# EAGLE design Slider01 (EAGLE 6.5.0)
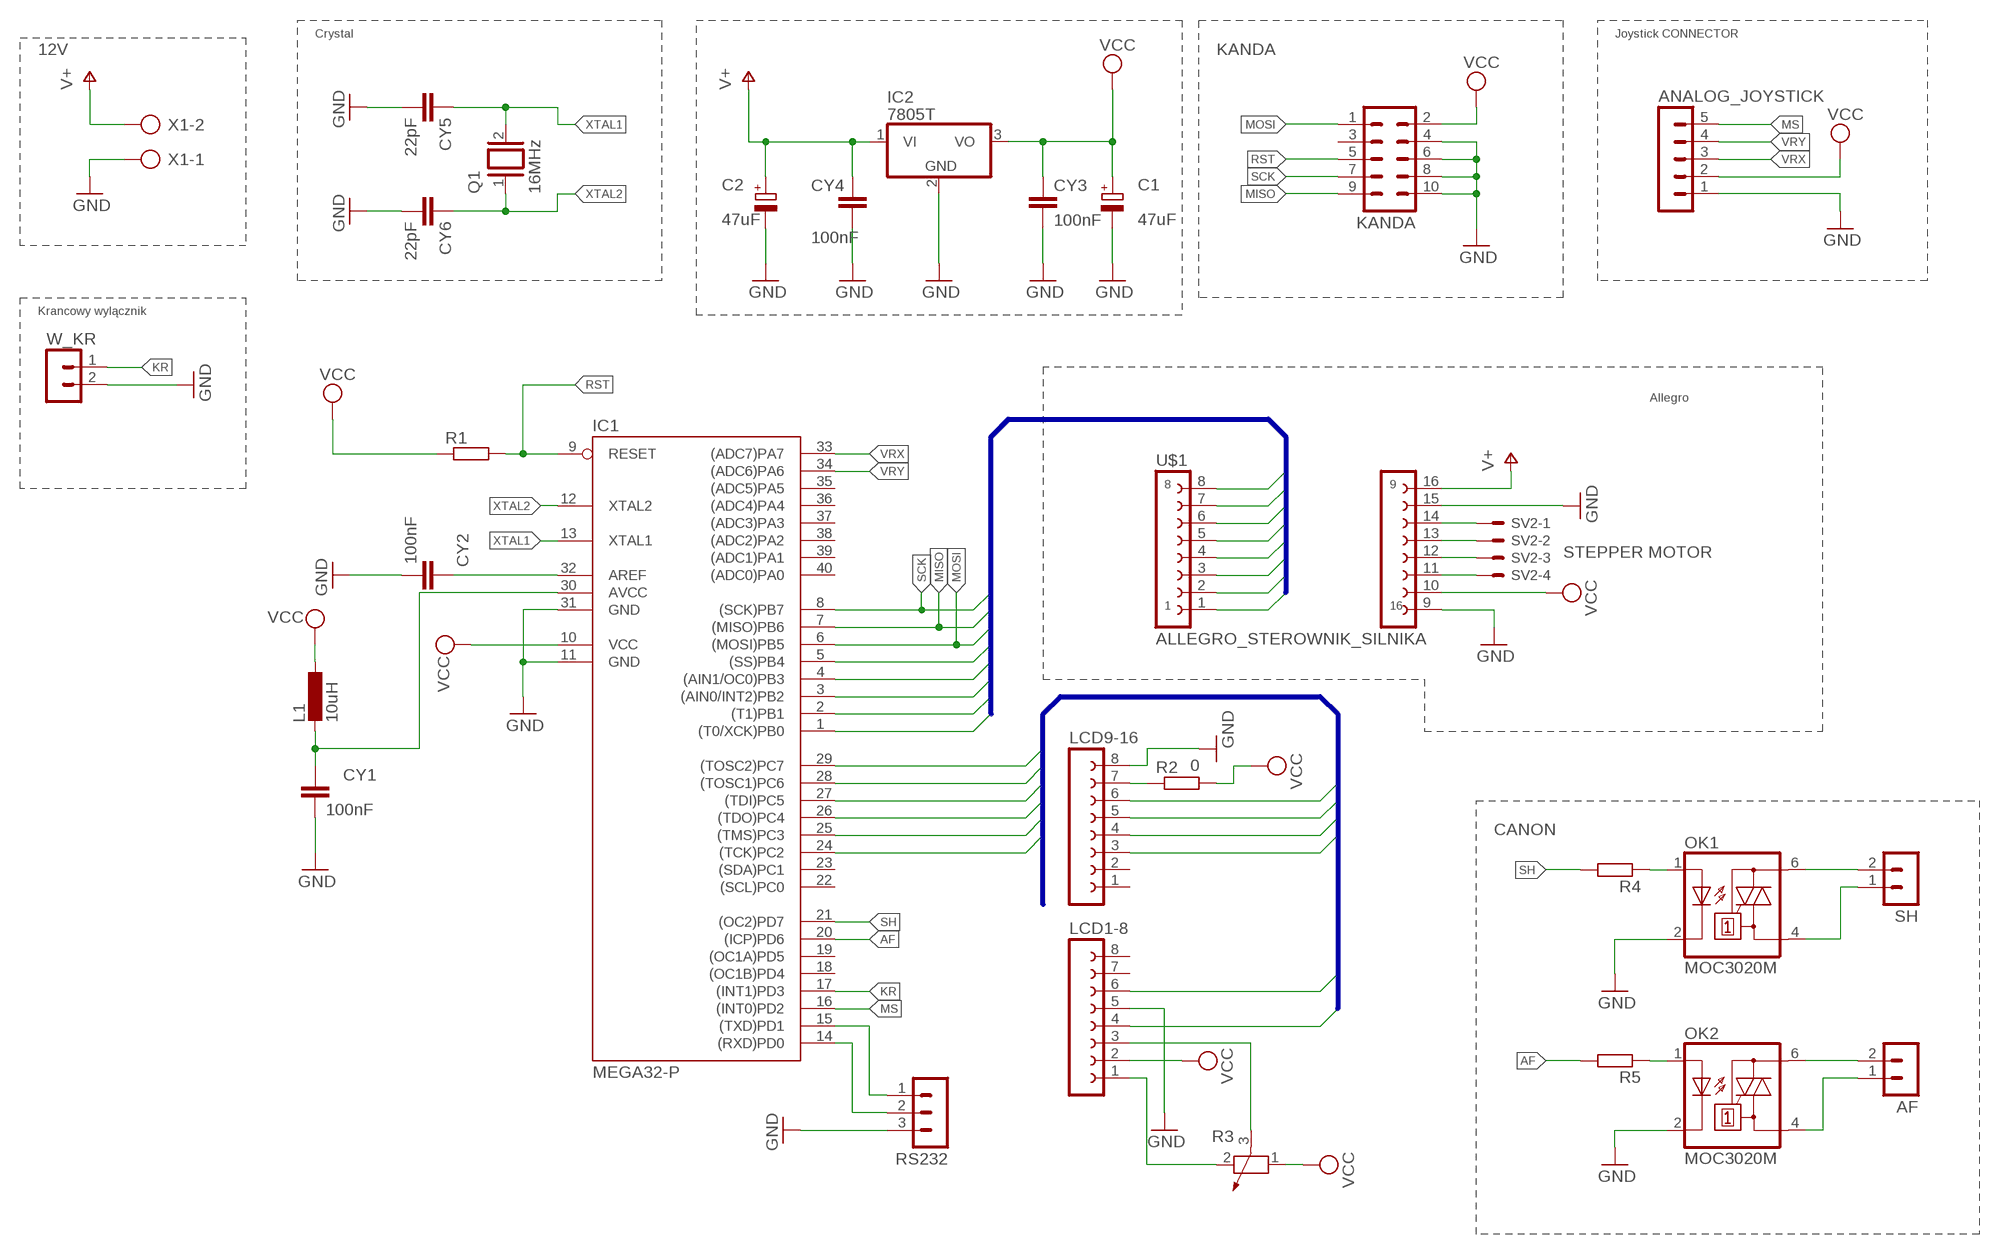
[diagram p0: schematic, sheet 1]

## Parts
AF  LSTB2  [LSTB2]
ANALOG_JOYSTICK  MA05-1  [MA05-1]
C1  47uF  CPOL-EUE5-6  [E5-6]
C2  47uF  CPOL-EUE5-6  [E5-6]
CY1  100nF  C-EU050-024X044  [C050-024X044]
CY2  100nF  C-EU050-024X044  [C050-024X044]
CY3  100nF  C-EU050-024X044  [C050-024X044]
CY4  100nF  C-EU050-024X044  [C050-024X044]
CY5  22pF  C-EUC1206  [C1206]
CY6  22pF  C-EUC1206  [C1206]
IC1  MEGA32-P  [DIL40]
IC2  7805T  [TO220H]
KANDA  MA05-2  [MA05-2]
L1  10uH  L-EU0207/10  [0207/10]
LCD1-8  FE08-1  [FE08]
LCD9-16  FE08-1  [FE08]
OK1  MOC3020M  [DIL06]
OK2  MOC3020M  [DIL06]
Q1  16MHz  XTAL/S  [QS]
R1  R-EU_0207/7  [0207/7]
R2  0  R-EU_0207/12  [0207/12]
R3  POTENTIOMETER_PT-10  [PT-10]
R4  R-EU_0207/7  [0207/7]
R5  R-EU_0207/7  [0207/7]
RS232  MA03-1  [MA03-1]
SH  LSTB2  [LSTB2]
SV2  KK-156-4  [KK-156-4]
U$1  ALLEGRO_STEROWNIK_SILNIKA  [ALLEGRO_STEROWNIK]
W_KR  LSTB2  [LSTB2]
X1  AK500/2  [AK500/2]

## Nets
#E: IC1.25((TMS)PC3) LCD1-8.6
AF: IC1.20((ICP)PD6) R5.2
D4: IC1.26((TDO)PC4) LCD9-16.3
D5: IC1.27((TDI)PC5) LCD9-16.4
D6: IC1.28((TOSC1)PC6) LCD9-16.5
D7: IC1.29((TOSC2)PC7) LCD9-16.6
GND: ANALOG_JOYSTICK.1 C1.- C2.- CY1.2 CY2.2 CY3.2 CY4.2 CY5.2 CY6.2 IC1.11(GND) IC1.31(GND) IC2.2(GND) KANDA.4 KANDA.6 KANDA.8 KANDA.10 LCD1-8.5 LCD9-16.8 OK1.2(C) OK2.2(C) RS232.3 U$1.9(A16) U$1.15(A10) W_KR.2 X1.1
KR: IC1.17((INT1)PD3) W_KR.1
MISO: IC1.7((MISO)PB6) KANDA.9 U$1.7
MOSI: IC1.6((MOSI)PB5) KANDA.1 U$1.6
MS: ANALOG_JOYSTICK.5 IC1.16((INT0)PD2)
N$1: SV2.1 U$1.14(A11)
N$2: SV2.2 U$1.13(A12)
N$3: SV2.3 U$1.12(A13)
N$4: SV2.4 U$1.11(A14)
N$5: LCD9-16.7 R2.1
N$6: CY2.1 IC1.32(AREF)
N$7: CY1.1 IC1.30(AVCC) L1.2
N$8: LCD1-8.1 R3.2
N$9: LCD1-8.3 R3.3
N$10: OK1.1(A) R4.1
N$11: OK2.1(A) R5.1
N$12: OK1.6(A2) SH.2
N$13: OK1.4(A1) SH.1
N$14: AF.2 OK2.6(A2)
N$15: AF.1 OK2.4(A1)
N$16: IC1.15((TXD)PD1) RS232.1
N$17: IC1.14((RXD)PD0) RS232.2
PB0: IC1.1((T0/XCK)PB0) U$1.1
PB1: IC1.2((T1)PB1) U$1.2
PB2: IC1.3((AIN0/INT2)PB2) U$1.3
PB3: IC1.4((AIN1/OC0)PB3) U$1.4
PB4: IC1.5((SS)PB4) U$1.5
RS: IC1.24((TCK)PC2) LCD1-8.4
RST: IC1.9(RESET) KANDA.5 R1.2
SCK: IC1.8((SCK)PB7) KANDA.7 U$1.8
SH: IC1.21((OC2)PD7) R4.2
V+: C2.+ CY4.1 IC2.1(VI) U$1.16(A9) X1.2
VCC: ANALOG_JOYSTICK.2 C1.+ CY3.1 IC1.10(VCC) IC2.3(VO) KANDA.2 L1.1 LCD1-8.2 R1.1 R2.2 R3.1 U$1.10(A15)
VRX: ANALOG_JOYSTICK.3 IC1.33((ADC7)PA7)
VRY: ANALOG_JOYSTICK.4 IC1.34((ADC6)PA6)
XTAL1: CY5.1 IC1.13(XTAL1) Q1.2
XTAL2: CY6.1 IC1.12(XTAL2) Q1.1
Unconnected: IC1.18((OC1B)PD4) IC1.19((OC1A)PD5) IC1.22((SCL)PC0) IC1.23((SDA)PC1) IC1.35((ADC5)PA5) IC1.36((ADC4)PA4) IC1.37((ADC3)PA3) IC1.38((ADC2)PA2) IC1.39((ADC1)PA1) IC1.40((ADC0)PA0) KANDA.3 LCD1-8.7 LCD1-8.8 LCD9-16.1 LCD9-16.2

## Buses
PB[0..4],MISO,MOSI,SCK,SS
D[4..7],RS,#E

## Notes on the sheet
- Crystal | Joystick CONNECTOR
- 12V | KANDA
- Krancowy wylącznik
- Allegro
- STEPPER MOTOR
- CANON

## Library data of the parts
AF SH W_KR = _My_Zlacza_nietypowe:LSTB2
ANALOG_JOYSTICK = con-lstb:MA05-1: PIN HEADER; OC_FARNELL: unknown; OC_NEWARK: unknown
C1 C2 = rcl:CPOL-EU: POLARIZED CAPACITOR, European symbol
CY1-CY6 = rcl:C-EU: CAPACITOR, European symbol
IC1 = atmel:MEGA32-P: MICROCONTROLLER 32 Kbytes FLASH 2 Kbytes SRAM 1 Kbytes EEPROM USART 8-channel 10 bit ADC Source: www.atmel.com .. doc2503.pdf; MPN: ATMEGA32-16PU; OC_FARNELL: 1661729; OC_NEWARK: 51P1794
IC2 = linear:78*: Positive VOLTAGE REGULATOR Source: http://cache.national.com/ds/LM/LM78L05.pdf http://www.fairchildsemi.com/ds/LM/LM7805.pdf
KANDA = con-lstb:MA05-2: PIN HEADER; OC_FARNELL: unknown; OC_NEWARK: unknown
L1 = rcl:L-EU: INDUCTOR, European symbol
LCD1-8 LCD9-16 = con-lsta:FE08-1: FEMALE HEADER; OC_FARNELL: unknown; OC_NEWARK: unknown
OK1 OK2 = optocoupler:MOC30*M: RANDOM-PHASE OPTOISOLATORS TRIAC DRIVER OUTPUT Source: http://www.fairchildsemi.com MOC3020-M.pdf; MF: FAIRCHILD SEMICONDUCTOR; MPN: MOC3020-M; OC_FARNELL: 1505425; OC_NEWARK: 72K8895
Q1 = special:XTAL/S: CRYSTAL
R1 R2 R4 R5 = rcl:R-EU_: RESISTOR, European symbol
R3 = rcl:POTENTIOMETER_: Potentiometer
RS232 = con-lstb:MA03-1: PIN HEADER; OC_FARNELL: unknown; OC_NEWARK: unknown
SV2 = con-molex:KK-156-4: KK 156 HEADER Source: http://www.molex.com/pdm_docs/sd/026604100_sd.pdf; OC_FARNELL: unknown; OC_NEWARK: unknown
U$1 = _My_trafko:ALLEGRO_STEROWNIK_SILNIKA
X1 = con-ptr500:AK500/2: CONNECTOR; OC_FARNELL: unknown; OC_NEWARK: unknown

## Board
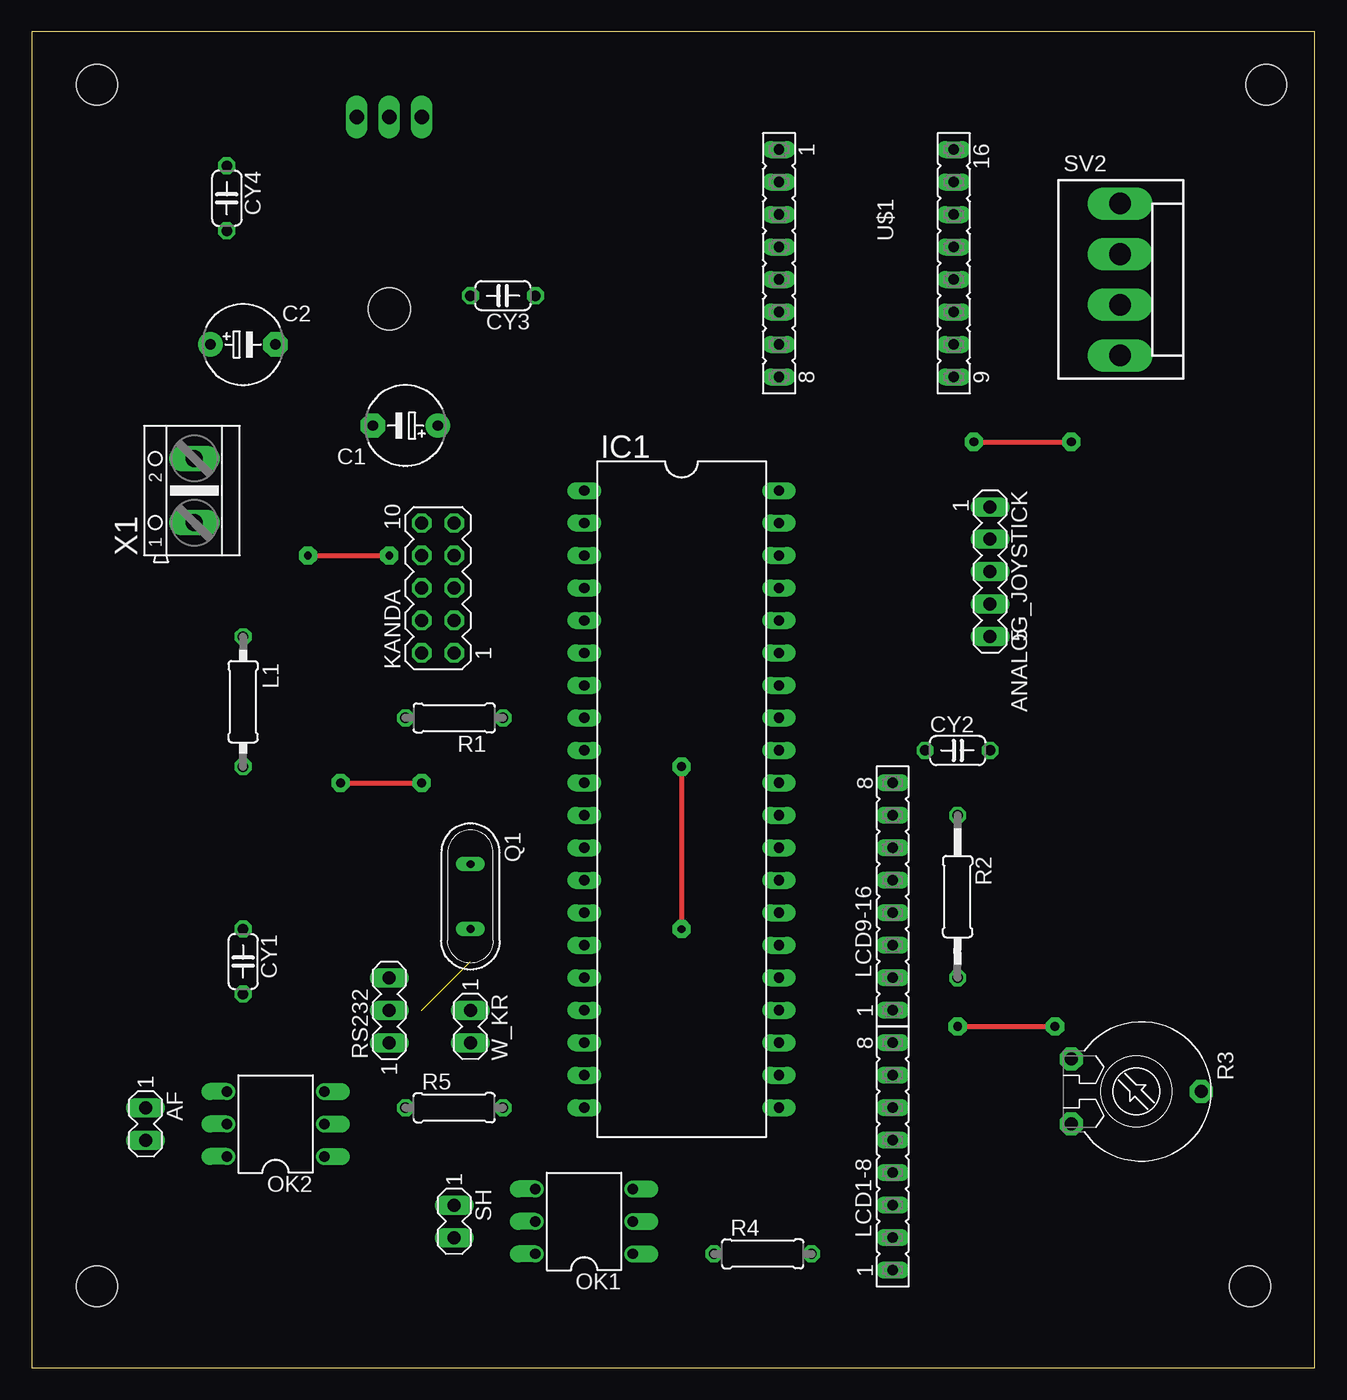
[diagram p1: board, top side]
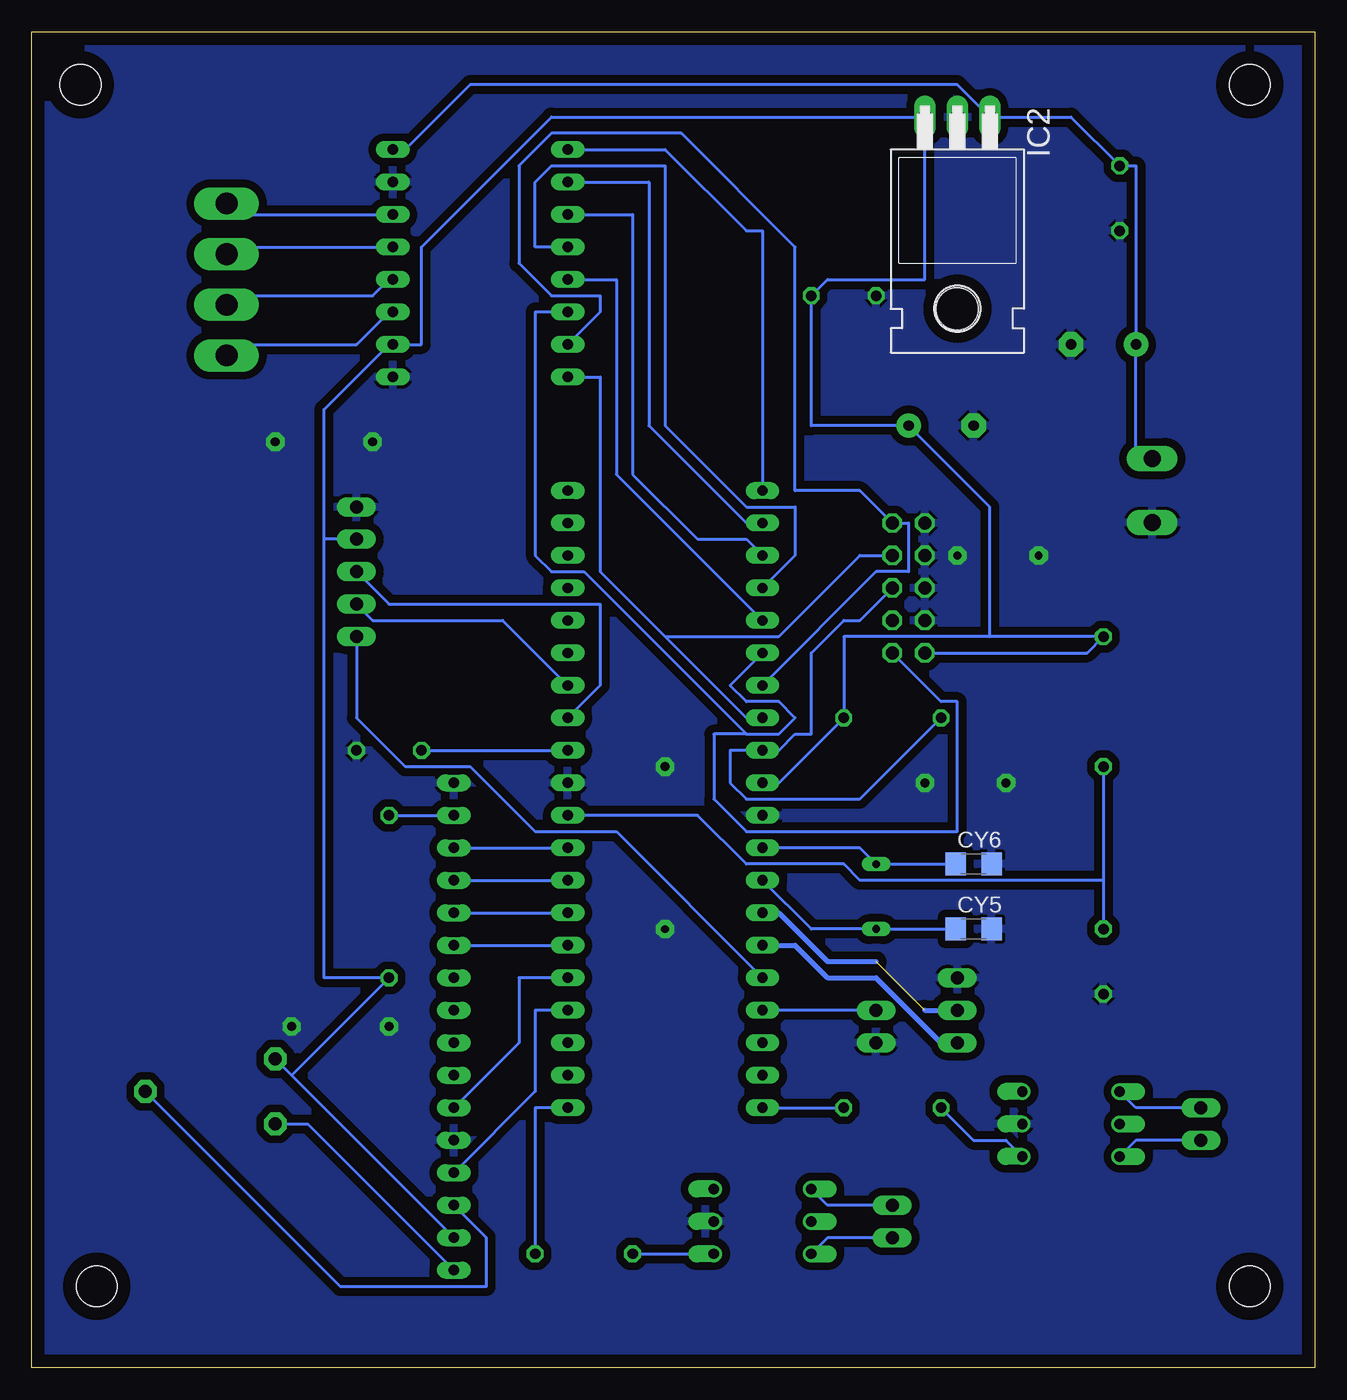
[diagram p2: board, bottom side, seen from below]

Size 100.31 x 104.44 mm. Coordinates in mm from the lower left corner, seen from the top.
Outline: 0,0 100.31,0 100.31,104.44 0,104.44 0,0
Copper layers (1*16): Top 0.035mm / dielectric 1.5mm / Bottom 0.035mm
Design rules "default *": minimum track width 10mil, minimum drill 24mil, track to track 8mil, track to pad 8mil, pad to pad 8mil, via to via 8mil, smd to smd 8mil, copper to edge 40mil, drill to drill 8mil, minimum pad ring 10mil, minimum via ring 8mil, stop-mask expansion 4mil, vias tented up to drill 0mil, thermal gap 10mil
Holes 3.2 mm at 5.08,100.33 96.52,100.33 95.25,6.35 5.08,6.35

### Footprints (pad centres in the part's own frame; a part is rotated, then mirrored left to right if it is on the bottom)
LSTB2 = drill 1.016 long: 1 -1.27,0; 2 1.27,0
MA05-1 = drill 1.016 long: 1 -5.08,0; 2 -2.54,0; 3 0,0; 4 2.54,0; 5 5.08,0
E5-6 = drill 0.813 pad 1.905: + -2.54,0 | drill 0.813 pad 1.905 octagon: - 2.54,0
C050-024X044 = drill 0.813 octagon: 1 -2.54,0; 2 2.54,0
C1206 = smd 1.6 x 1.8: 1 -1.4,0; 2 1.4,0
DIL40 = drill 0.813 long: 1 -24.13,-7.62; 2 -21.59,-7.62; 3 -19.05,-7.62; 4 -16.51,-7.62; 5 -13.97,-7.62; 6 -11.43,-7.62; 7 -8.89,-7.62; 8 -6.35,-7.62; 9 -3.81,-7.62; 10 -1.27,-7.62; 11 1.27,-7.62; 12 3.81,-7.62; 13 6.35,-7.62; 14 8.89,-7.62; 15 11.43,-7.62; 16 13.97,-7.62; 17 16.51,-7.62; 18 19.05,-7.62; 19 21.59,-7.62; 20 24.13,-7.62; 21 24.13,7.62; 22 21.59,7.62; 23 19.05,7.62; 24 16.51,7.62; 25 13.97,7.62; 26 11.43,7.62; 27 8.89,7.62; 28 6.35,7.62; 29 3.81,7.62; 30 1.27,7.62; 31 -1.27,7.62; 32 -3.81,7.62; 33 -6.35,7.62; 34 -8.89,7.62; 35 -11.43,7.62; 36 -13.97,7.62; 37 -16.51,7.62; 38 -19.05,7.62; 39 -21.59,7.62; 40 -24.13,7.62
TO220H = drill 1.118 long: 1 -2.54,-10.16; 2 0,-10.16; 3 2.54,-10.16 | hole 3.302: 0,4.826
MA05-2 = drill 1.016 octagon: 1 -5.08,-1.27; 2 -5.08,1.27; 3 -2.54,-1.27; 4 -2.54,1.27; 5 0,-1.27; 6 0,1.27; 7 2.54,-1.27; 8 2.54,1.27; 9 5.08,-1.27; 10 5.08,1.27
0207/10 = drill 0.813 octagon: 1 -5.08,0; 2 5.08,0
FE08 = drill 0.813 long: 1 -8.89,0; 2 -6.35,0; 3 -3.81,0; 4 -1.27,0; 5 1.27,0; 6 3.81,0; 7 6.35,0; 8 8.89,0
DIL06 = drill 0.813 offset: 1 -2.54,-3.81; 2 0,-3.81; 3 2.54,-3.81; 4 2.54,3.81; 5 0,3.81; 6 -2.54,3.81
QS = drill 0.61 long: 1 -2.54,0; 2 2.54,0
0207/7 = drill 0.813 octagon: 1 -3.81,0; 2 3.81,0
0207/12 = drill 0.813 octagon: 1 -6.35,0; 2 6.35,0
PT-10 = drill 1.016 pad 1.778 octagon: 1 -2.54,-5.08; 2 2.54,-5.08; 3 0,5.08
MA03-1 = drill 1.016 long: 1 -2.54,0; 2 0,0; 3 2.54,0
KK-156-4 = drill 1.7 pad 2.184 long: 1 -5.94,0; 2 -1.98,0; 3 1.98,0; 4 5.94,0
ALLEGRO_STEROWNIK = drill 0.813 long: 1 0,0; 2 2.54,0; 3 5.08,0; 4 7.62,0; 5 10.16,0; 6 12.7,0; 7 15.24,0; 8 17.78,0; 9 17.78,13.665; 10 15.24,13.665; 11 12.7,13.665; 12 10.16,13.665; 13 7.62,13.665; 14 5.08,13.665; 15 2.54,13.665; 16 0,13.665
AK500/2 = drill 1.321 long: 1 -2.515,0; 2 2.515,0

### Placement (x,y rotation side)
AF  8.89,19.05 270 top
ANALOG_JOYSTICK  74.93,62.23 270 top
C1  29.21,73.66 180 top
C2  16.51,80.01 0 top
CY1  16.51,31.75 270 top
CY2  72.39,48.26 0 top
CY3  36.83,83.82 180 top
CY4  15.24,91.44 270 top
CY5  26.67,34.29 0 bottom
CY6  26.67,39.37 0 bottom
IC1  50.8,44.45 270 top
IC2  27.94,87.63 180 bottom
KANDA  31.75,60.96 90 top
L1  16.51,52.07 270 top
LCD1-8  67.31,16.51 90 top
LCD9-16  67.31,36.83 90 top
OK1  43.18,11.43 90 top
OK2  19.05,19.05 90 top
Q1  34.29,36.83 270 top
R1  33.02,50.8 180 top
R2  72.39,36.83 270 top
R3  86.36,21.59 270 top
R4  57.15,8.89 0 top
R5  33.02,20.32 0 top
RS232  27.94,27.94 90 top
SH  33.02,11.43 270 top
SV2  85.09,85.09 270 top
U$1  58.42,95.25 270 top
W_KR  34.29,26.67 270 top
X1  12.7,68.58 90 top

### Tracks (layer width: path | path; a pad name or v marks a point on that pad's centre or on a via)
#E
  Bottom 0.254: LCD1-8.6 62.23,25.4 62.23,30.48 IC1.25
AF
  Bottom 0.254: IC1.20 R5.2
D4
  Bottom 0.254: LCD9-16.3 IC1.26
D5
  Bottom 0.254: LCD9-16.4 IC1.27
D6
  Bottom 0.254: LCD9-16.5 IC1.28
D7
  Bottom 0.254: LCD9-16.6 IC1.29
GND  (via drill 0.6 pad 1.42, 0.7 pad 1.42)
  Top 0.406: v50.8,46.99 v50.8,34.29 | v24.13,45.72 v30.48,45.72 | v21.59,63.5 v27.94,63.5 | v72.39,26.67 v80.01,26.67 | v73.66,72.39 v81.28,72.39
  pour Bottom (isolate 0.61): -8.89,142.24 133.35,142.24 133.35,-6.35 -8.89,-6.35
KR
  Bottom 0.254: W_KR.1 IC1.17
MISO
  Bottom 0.254: IC1.7 34.29,62.23 31.75,62.23 31.75,66.04 KANDA.9 35.56,68.58 40.64,68.58 40.64,87.63 49.53,96.52 59.69,96.52 62.23,93.98 62.23,86.36 59.69,83.82 55.88,83.82 55.88,82.55 U$1.7
MOSI
  Bottom 0.254: IC1.6 45.72,53.34 44.45,52.07 41.91,52.07 40.64,50.8 41.91,49.53 44.45,49.53 | 44.45,49.53 57.15,62.23 59.69,62.23 60.96,63.5 60.96,82.55 U$1.6 | KANDA.1 29.21,52.07 27.94,52.07 27.94,41.91 44.45,41.91 46.99,44.45 46.99,49.53 44.45,49.53
MS
  Bottom 0.254: IC1.16 54.61,41.91 60.96,41.91 66.04,46.99 71.12,46.99 74.93,50.8 ANALOG_JOYSTICK.5
N$1
  Bottom 0.254: U$1.14 85.09,90.17 SV2.1
N$2
  Bottom 0.254: U$1.13 85.09,87.63 SV2.2
N$3
  Bottom 0.254: U$1.12 72.39,85.09 73.66,83.82 85.09,83.82 SV2.3
N$4
  Bottom 0.254: U$1.11 72.39,82.55 74.93,80.01 85.09,80.01 SV2.4
N$5
  Bottom 0.254: R2.1 LCD9-16.7
N$6
  Bottom 0.254: CY2.1 IC1.32
N$7
  Bottom 0.254: L1.2 16.51,38.1 | 16.51,38.1 CY1.1 | IC1.30 48.26,43.18 44.45,39.37 36.83,39.37 35.56,38.1 16.51,38.1
N$8
  Bottom 0.254: LCD1-8.1 78.74,19.05 R3.2
N$9
  Bottom 0.254: LCD1-8.3 64.77,10.16 64.77,6.35 76.2,6.35 R3.3
N$10
  Bottom 0.254: R4.1 OK1.1
N$11
  Bottom 0.254: OK2.1 24.13,17.78 26.67,17.78 R5.1
N$12
  Bottom 0.254: OK1.6 38.1,10.16 SH.2
N$13
  Bottom 0.254: OK1.4 38.1,12.7 SH.1
N$14
  Bottom 0.254: OK2.6 13.97,17.78 AF.2
N$15
  Bottom 0.254: OK2.4 13.97,20.32 AF.1
N$16
  Bottom 0.406: IC1.15 40.64,33.02 38.1,30.48 34.29,30.48 29.21,25.4 RS232.1
N$17  (1 unrouted)
  Bottom 0.406: IC1.14 41.91,35.56 38.1,31.75 34.29,31.75 | 30.48,27.94 RS232.2
PB0
  Bottom 0.254: IC1.1 43.18,88.9 44.45,88.9 50.8,95.25 U$1.1
PB1
  Bottom 0.254: IC1.2 44.45,66.04 52.07,73.66 52.07,92.71 U$1.2
PB2
  Bottom 0.254: IC1.3 44.45,64.77 48.26,64.77 53.34,69.85 53.34,90.17 U$1.3
PB3
  Bottom 0.254: IC1.4 40.64,63.5 40.64,67.31 44.45,67.31 50.8,73.66 50.8,93.98 59.69,93.98 60.96,92.71 60.96,87.63 U$1.4
PB4
  Bottom 0.254: IC1.5 54.61,69.85 54.61,85.09 U$1.5
RS
  Bottom 0.254: LCD1-8.4 60.96,21.59 60.96,27.94 IC1.24
RST
  Bottom 0.254: R1.2 35.56,44.45 44.45,44.45 45.72,45.72 45.72,48.26 IC1.9 41.91,48.26 40.64,49.53 39.37,49.53 39.37,55.88 36.83,58.42 35.56,58.42 KANDA.5
SCK
  Bottom 0.254: IC1.8 44.45,50.8 50.8,57.15 | 50.8,57.15 55.88,62.23 55.88,77.47 U$1.8 | KANDA.7 35.56,63.5 41.91,57.15 50.8,57.15
SH
  Bottom 0.254: R4.2 60.96,20.32 IC1.21
V+
  Bottom 0.254: X1.2 12.7,71.12 13.97,71.12 C2.+ 13.97,93.98 CY4.1 19.05,97.79 IC2.1 27.94,100.33 66.04,100.33 71.12,95.25 U$1.16
VCC
  Bottom 0.254: IC1.10 41.91,45.72 R1.1 36.83,57.15 25.4,57.15 | KANDA.2 17.78,55.88 L1.1 25.4,57.15 | 25.4,57.15 25.4,67.31 C1.+ 39.37,73.66 CY3.1 38.1,85.09 30.48,85.09 IC2.3 59.69,97.79 69.85,87.63 69.85,80.01 U$1.10 72.39,80.01 77.47,74.93 77.47,64.77 | ANALOG_JOYSTICK.2 77.47,64.77 | R3.1 80.01,22.86 | 80.01,22.86 LCD1-8.2 | 80.01,22.86 R2.2 77.47,30.48 77.47,64.77
VRX
  Bottom 0.254: IC1.33 55.88,53.34 55.88,59.69 72.39,59.69 ANALOG_JOYSTICK.3
VRY
  Bottom 0.254: IC1.34 63.5,58.42 73.66,58.42 ANALOG_JOYSTICK.4
XTAL1
  Bottom 0.254: 27.94,34.29 CY5.1 Q1.2 39.37,34.29 IC1.13
XTAL2
  Bottom 0.254: 27.94,39.37 CY6.1 Q1.1 35.56,40.64 IC1.12